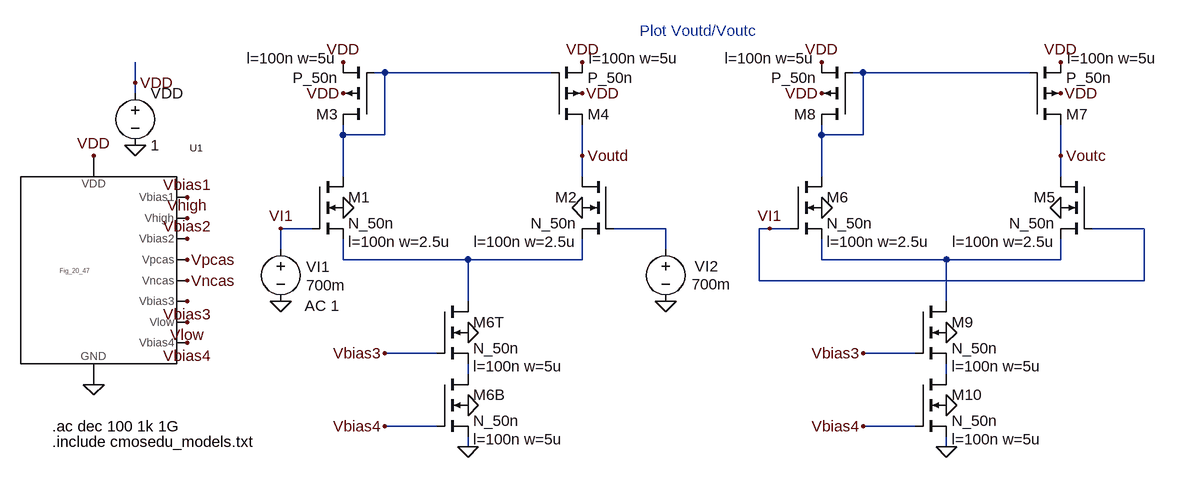
[diagram p0: schematic Fig22_16.asc]
Fig22_16.asc, the LTspice schematic file:
Version 4
SHEET 1 2752 680
WIRE 1248 -368 1232 -368
WIRE 1504 -368 1248 -368
WIRE 1984 -368 1968 -368
WIRE 2240 -368 1984 -368
WIRE 864 -352 864 -384
WIRE 864 -336 864 -352
WIRE 1184 -272 1184 -288
WIRE 1248 -272 1248 -368
WIRE 1248 -272 1184 -272
WIRE 1920 -272 1920 -288
WIRE 1984 -272 1984 -368
WIRE 1984 -272 1920 -272
WIRE 1552 -240 1552 -288
WIRE 2288 -240 2288 -288
WIRE 1184 -208 1184 -272
WIRE 1552 -208 1552 -240
WIRE 1920 -208 1920 -272
WIRE 2288 -208 2288 -240
WIRE 1136 -128 1088 -128
WIRE 1680 -128 1600 -128
WIRE 1840 -128 1824 -128
WIRE 1872 -128 1840 -128
WIRE 2416 -128 2336 -128
WIRE 1088 -96 1088 -128
WIRE 1680 -96 1680 -128
WIRE 1184 -80 1184 -112
WIRE 1376 -80 1184 -80
WIRE 1552 -80 1552 -112
WIRE 1552 -80 1376 -80
WIRE 1920 -80 1920 -112
WIRE 2112 -80 1920 -80
WIRE 2288 -80 2288 -112
WIRE 2288 -80 2112 -80
WIRE 1824 -48 1824 -128
WIRE 2416 -48 2416 -128
WIRE 2416 -48 1824 -48
WIRE 1376 -16 1376 -80
WIRE 2112 -16 2112 -80
WIRE 1328 64 1248 64
WIRE 2064 64 1984 64
WIRE 1376 96 1376 80
WIRE 2112 96 2112 80
WIRE 1328 176 1248 176
WIRE 2064 176 1984 176
WIRE 1376 208 1376 192
WIRE 2112 208 2112 192
FLAG 864 -256 0
FLAG 864 -352 VDD
FLAG 1552 -160 0
FLAG 1376 208 0
FLAG 1184 -160 0
FLAG 1552 -384 VDD
FLAG 1552 -336 VDD
FLAG 1184 -336 VDD
FLAG 800 -240 VDD
FLAG 800 112 0
FLAG 944 -176 Vbias1
FLAG 944 -144 Vhigh
FLAG 944 -112 Vbias2
FLAG 944 -16 Vbias3
FLAG 944 -80 Vpcas
FLAG 944 -48 Vncas
FLAG 944 48 Vbias4
FLAG 944 16 Vlow
FLAG 1088 -16 0
FLAG 1184 -384 VDD
FLAG 1376 32 0
FLAG 1376 144 0
FLAG 1248 64 Vbias3
FLAG 1248 176 Vbias4
FLAG 1680 -16 0
FLAG 2288 -160 0
FLAG 2112 208 0
FLAG 1920 -160 0
FLAG 2288 -384 VDD
FLAG 2288 -336 VDD
FLAG 1920 -336 VDD
FLAG 1920 -384 VDD
FLAG 2112 32 0
FLAG 2112 144 0
FLAG 1984 64 Vbias3
FLAG 1984 176 Vbias4
FLAG 1840 -128 VI1
FLAG 1552 -240 Voutd
FLAG 2288 -240 Voutc
FLAG 1088 -128 VI1
SYMBOL voltage 864 -352 R0
WINDOW 123 0 0 Left 2
WINDOW 39 0 0 Left 2
SYMATTR InstName VDD
SYMATTR Value 1
SYMBOL nmos4 1600 -208 M0
WINDOW 123 56 100 Left 2
SYMATTR Value2 l=100n w=2.5u
SYMATTR InstName M2
SYMATTR Value N_50n
SYMBOL nmos4 1136 -208 R0
WINDOW 123 56 100 Left 2
SYMATTR Value2 l=100n w=2.5u
SYMATTR InstName M1
SYMATTR Value N_50n
SYMBOL pmos4 1504 -288 M180
WINDOW 123 58 102 Left 2
WINDOW 0 56 16 Left 2
SYMATTR Value2 l=100n w=5u
SYMATTR InstName M4
SYMATTR Value P_50n
SYMBOL pmos4 1232 -288 R180
WINDOW 123 58 102 Left 2
WINDOW 0 56 16 Left 2
SYMATTR Value2 l=100n w=5u
SYMATTR InstName M3
SYMATTR Value P_50n
SYMBOL Fig_20_47 800 -64 R0
SYMATTR InstName U1
SYMBOL voltage 1088 -112 R0
WINDOW 0 39 43 Left 2
WINDOW 123 37 103 Left 2
WINDOW 39 0 0 Left 2
WINDOW 3 39 71 Left 2
SYMATTR InstName VI1
SYMATTR Value2 AC 1
SYMATTR Value 700m
SYMBOL nmos4 1328 -16 R0
WINDOW 123 56 100 Left 2
SYMATTR Value2 l=100n w=5u
SYMATTR InstName M6T
SYMATTR Value N_50n
SYMBOL nmos4 1328 96 R0
WINDOW 123 56 100 Left 2
SYMATTR Value2 l=100n w=5u
SYMATTR InstName M6B
SYMATTR Value N_50n
SYMBOL voltage 1680 -112 R0
WINDOW 0 45 42 Left 2
WINDOW 3 40 70 Left 2
WINDOW 123 0 0 Left 2
WINDOW 39 0 0 Left 2
SYMATTR InstName VI2
SYMATTR Value 700m
SYMBOL nmos4 2336 -208 M0
WINDOW 123 56 100 Left 2
SYMATTR Value2 l=100n w=2.5u
SYMATTR InstName M5
SYMATTR Value N_50n
SYMBOL nmos4 1872 -208 R0
WINDOW 123 56 100 Left 2
SYMATTR Value2 l=100n w=2.5u
SYMATTR InstName M6
SYMATTR Value N_50n
SYMBOL pmos4 2240 -288 M180
WINDOW 123 58 102 Left 2
WINDOW 0 56 16 Left 2
SYMATTR Value2 l=100n w=5u
SYMATTR InstName M7
SYMATTR Value P_50n
SYMBOL pmos4 1968 -288 R180
WINDOW 123 58 102 Left 2
WINDOW 0 56 16 Left 2
SYMATTR Value2 l=100n w=5u
SYMATTR InstName M8
SYMATTR Value P_50n
SYMBOL nmos4 2064 -16 R0
WINDOW 123 56 100 Left 2
SYMATTR Value2 l=100n w=5u
SYMATTR InstName M9
SYMATTR Value N_50n
SYMBOL nmos4 2064 96 R0
WINDOW 123 56 100 Left 2
SYMATTR Value2 l=100n w=5u
SYMATTR InstName M10
SYMATTR Value N_50n
TEXT 736 200 Left 2 !.include cmosedu_models.txt
TEXT 1640 -432 Left 2 ;Plot Voutd/Voutc
TEXT 736 176 Left 2 !.ac dec 100 1k 1G

The netlist it stands for:
* Fig22_16.asc
VDD VDD 0 1
M2 Voutd N003 N004 0 N_50n l=100n w=2.5u
M1 N001 VI1 N004 0 N_50n l=100n w=2.5u
M4 Voutd N001 VDD VDD P_50n l=100n w=5u
M3 N001 N001 VDD VDD P_50n l=100n w=5u
XU1 Vbias1 Vhigh Vbias2 Vpcas Vncas Vbias3 Vlow Vbias4 VDD 0 Fig_20_47  ; pins Vbias1 Vhigh Vbias2 Vpcas Vncas Vbias3 Vlow Vbias4 VDD GND
VI1 VI1 0 700m AC 1
M6T N004 Vbias3 N006 0 N_50n l=100n w=5u
M6B N006 Vbias4 0 0 N_50n l=100n w=5u
VI2 N003 0 700m
M5 Voutc VI1 N005 0 N_50n l=100n w=2.5u
M6 N002 VI1 N005 0 N_50n l=100n w=2.5u
M7 Voutc N002 VDD VDD P_50n l=100n w=5u
M8 N002 N002 VDD VDD P_50n l=100n w=5u
M9 N005 Vbias3 N007 0 N_50n l=100n w=5u
M10 N007 Vbias4 0 0 N_50n l=100n w=5u
.model NMOS NMOS
.model PMOS PMOS
.lib standard.mos
.include cmosedu_models.txt
* Plot Voutd/Voutc
.ac dec 100 1k 1G
.backanno
.end